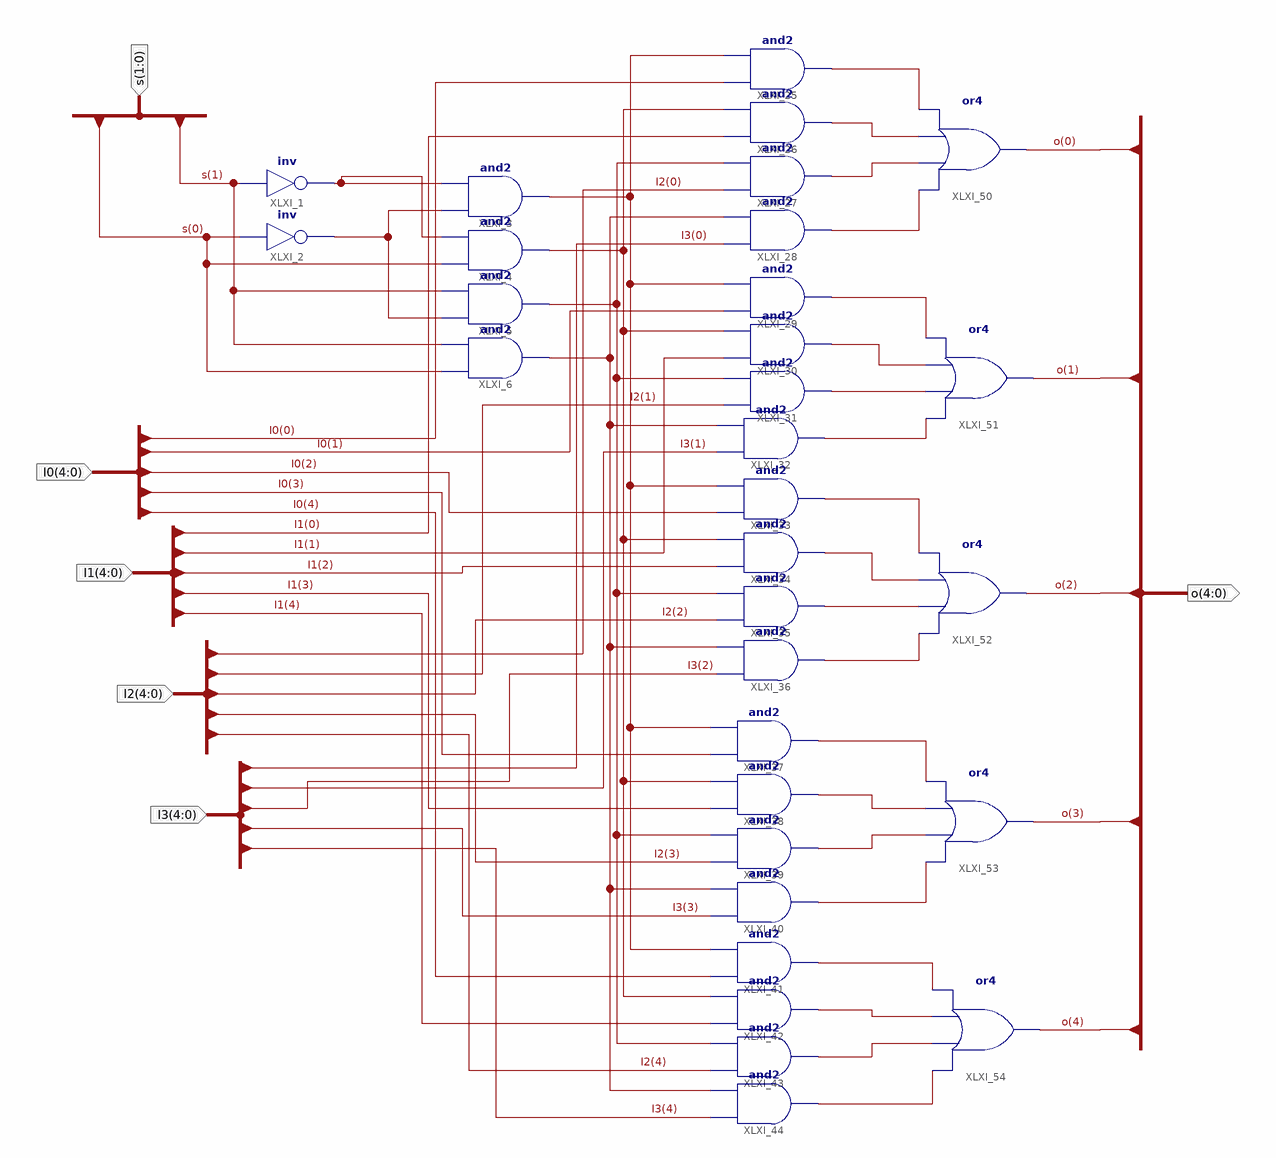
[diagram p0: schematic sheet 1]
// Xilinx ISE schematic MUX4T1_5.sch (kintex7) as structural Verilog: 31 symbols, 6 ports
module MUX4T1_5 (
  input  [4:0] I0,
  input  [4:0] I1,
  input  [4:0] I2,
  input  [4:0] I3,
  input  [1:0] s,
  output [4:0] o
);

  wire XLXN_6, XLXN_7, XLXN_25, XLXN_36, XLXN_49, XLXN_57, XLXN_66, XLXN_67, XLXN_68, XLXN_69, XLXN_70,
       XLXN_71, XLXN_72, XLXN_73, XLXN_80, XLXN_81, XLXN_82, XLXN_83, XLXN_84, XLXN_85, XLXN_86, XLXN_87,
       XLXN_88, XLXN_89, XLXN_90, XLXN_91;

  not XLXI_1 (XLXN_6, s[1]);
  not XLXI_2 (XLXN_7, s[0]);
  and XLXI_3 (XLXN_25, XLXN_7, XLXN_6);
  and XLXI_4 (XLXN_36, s[0], XLXN_6);
  and XLXI_5 (XLXN_49, XLXN_7, s[1]);
  and XLXI_6 (XLXN_57, s[0], s[1]);
  and XLXI_25 (XLXN_66, I0[0], XLXN_25);
  and XLXI_26 (XLXN_67, I1[0], XLXN_36);
  and XLXI_27 (XLXN_68, I2[0], XLXN_49);
  and XLXI_28 (XLXN_69, I3[0], XLXN_57);
  and XLXI_29 (XLXN_70, I0[1], XLXN_25);
  and XLXI_30 (XLXN_71, I1[1], XLXN_36);
  and XLXI_31 (XLXN_72, I2[1], XLXN_49);
  and XLXI_32 (XLXN_73, I3[1], XLXN_57);
  and XLXI_33 (XLXN_80, I0[2], XLXN_25);
  and XLXI_34 (XLXN_81, I1[2], XLXN_36);
  and XLXI_35 (XLXN_82, I2[2], XLXN_49);
  and XLXI_36 (XLXN_83, I3[2], XLXN_57);
  and XLXI_37 (XLXN_84, I0[3], XLXN_25);
  and XLXI_38 (XLXN_85, I1[3], XLXN_36);
  and XLXI_39 (XLXN_86, I2[3], XLXN_49);
  and XLXI_40 (XLXN_87, I3[3], XLXN_57);
  and XLXI_41 (XLXN_88, I0[4], XLXN_25);
  and XLXI_42 (XLXN_89, I1[4], XLXN_36);
  and XLXI_43 (XLXN_90, I2[4], XLXN_49);
  and XLXI_44 (XLXN_91, I3[4], XLXN_57);
  or XLXI_50 (o[0], XLXN_69, XLXN_68, XLXN_67, XLXN_66);
  or XLXI_51 (o[1], XLXN_73, XLXN_72, XLXN_71, XLXN_70);
  or XLXI_52 (o[2], XLXN_83, XLXN_82, XLXN_81, XLXN_80);
  or XLXI_53 (o[3], XLXN_87, XLXN_86, XLXN_85, XLXN_84);
  or XLXI_54 (o[4], XLXN_91, XLXN_90, XLXN_89, XLXN_88);
endmodule
